# Altium schematic sheet RelayModule_PWR.SchDoc: Релейный модуль
size 594 x 420 mm; ApprovedBy: Иванов; CheckedBy: Вакулин; DrawnBy: Подлесный; DocumentNumber: VSL.23-RELAYMODULE Э3; SheetNumber: 1; SheetTotal: 3; Format: A2; DocumentType: Схема электрическая принципиальная; ImagePath: Введите номер платы
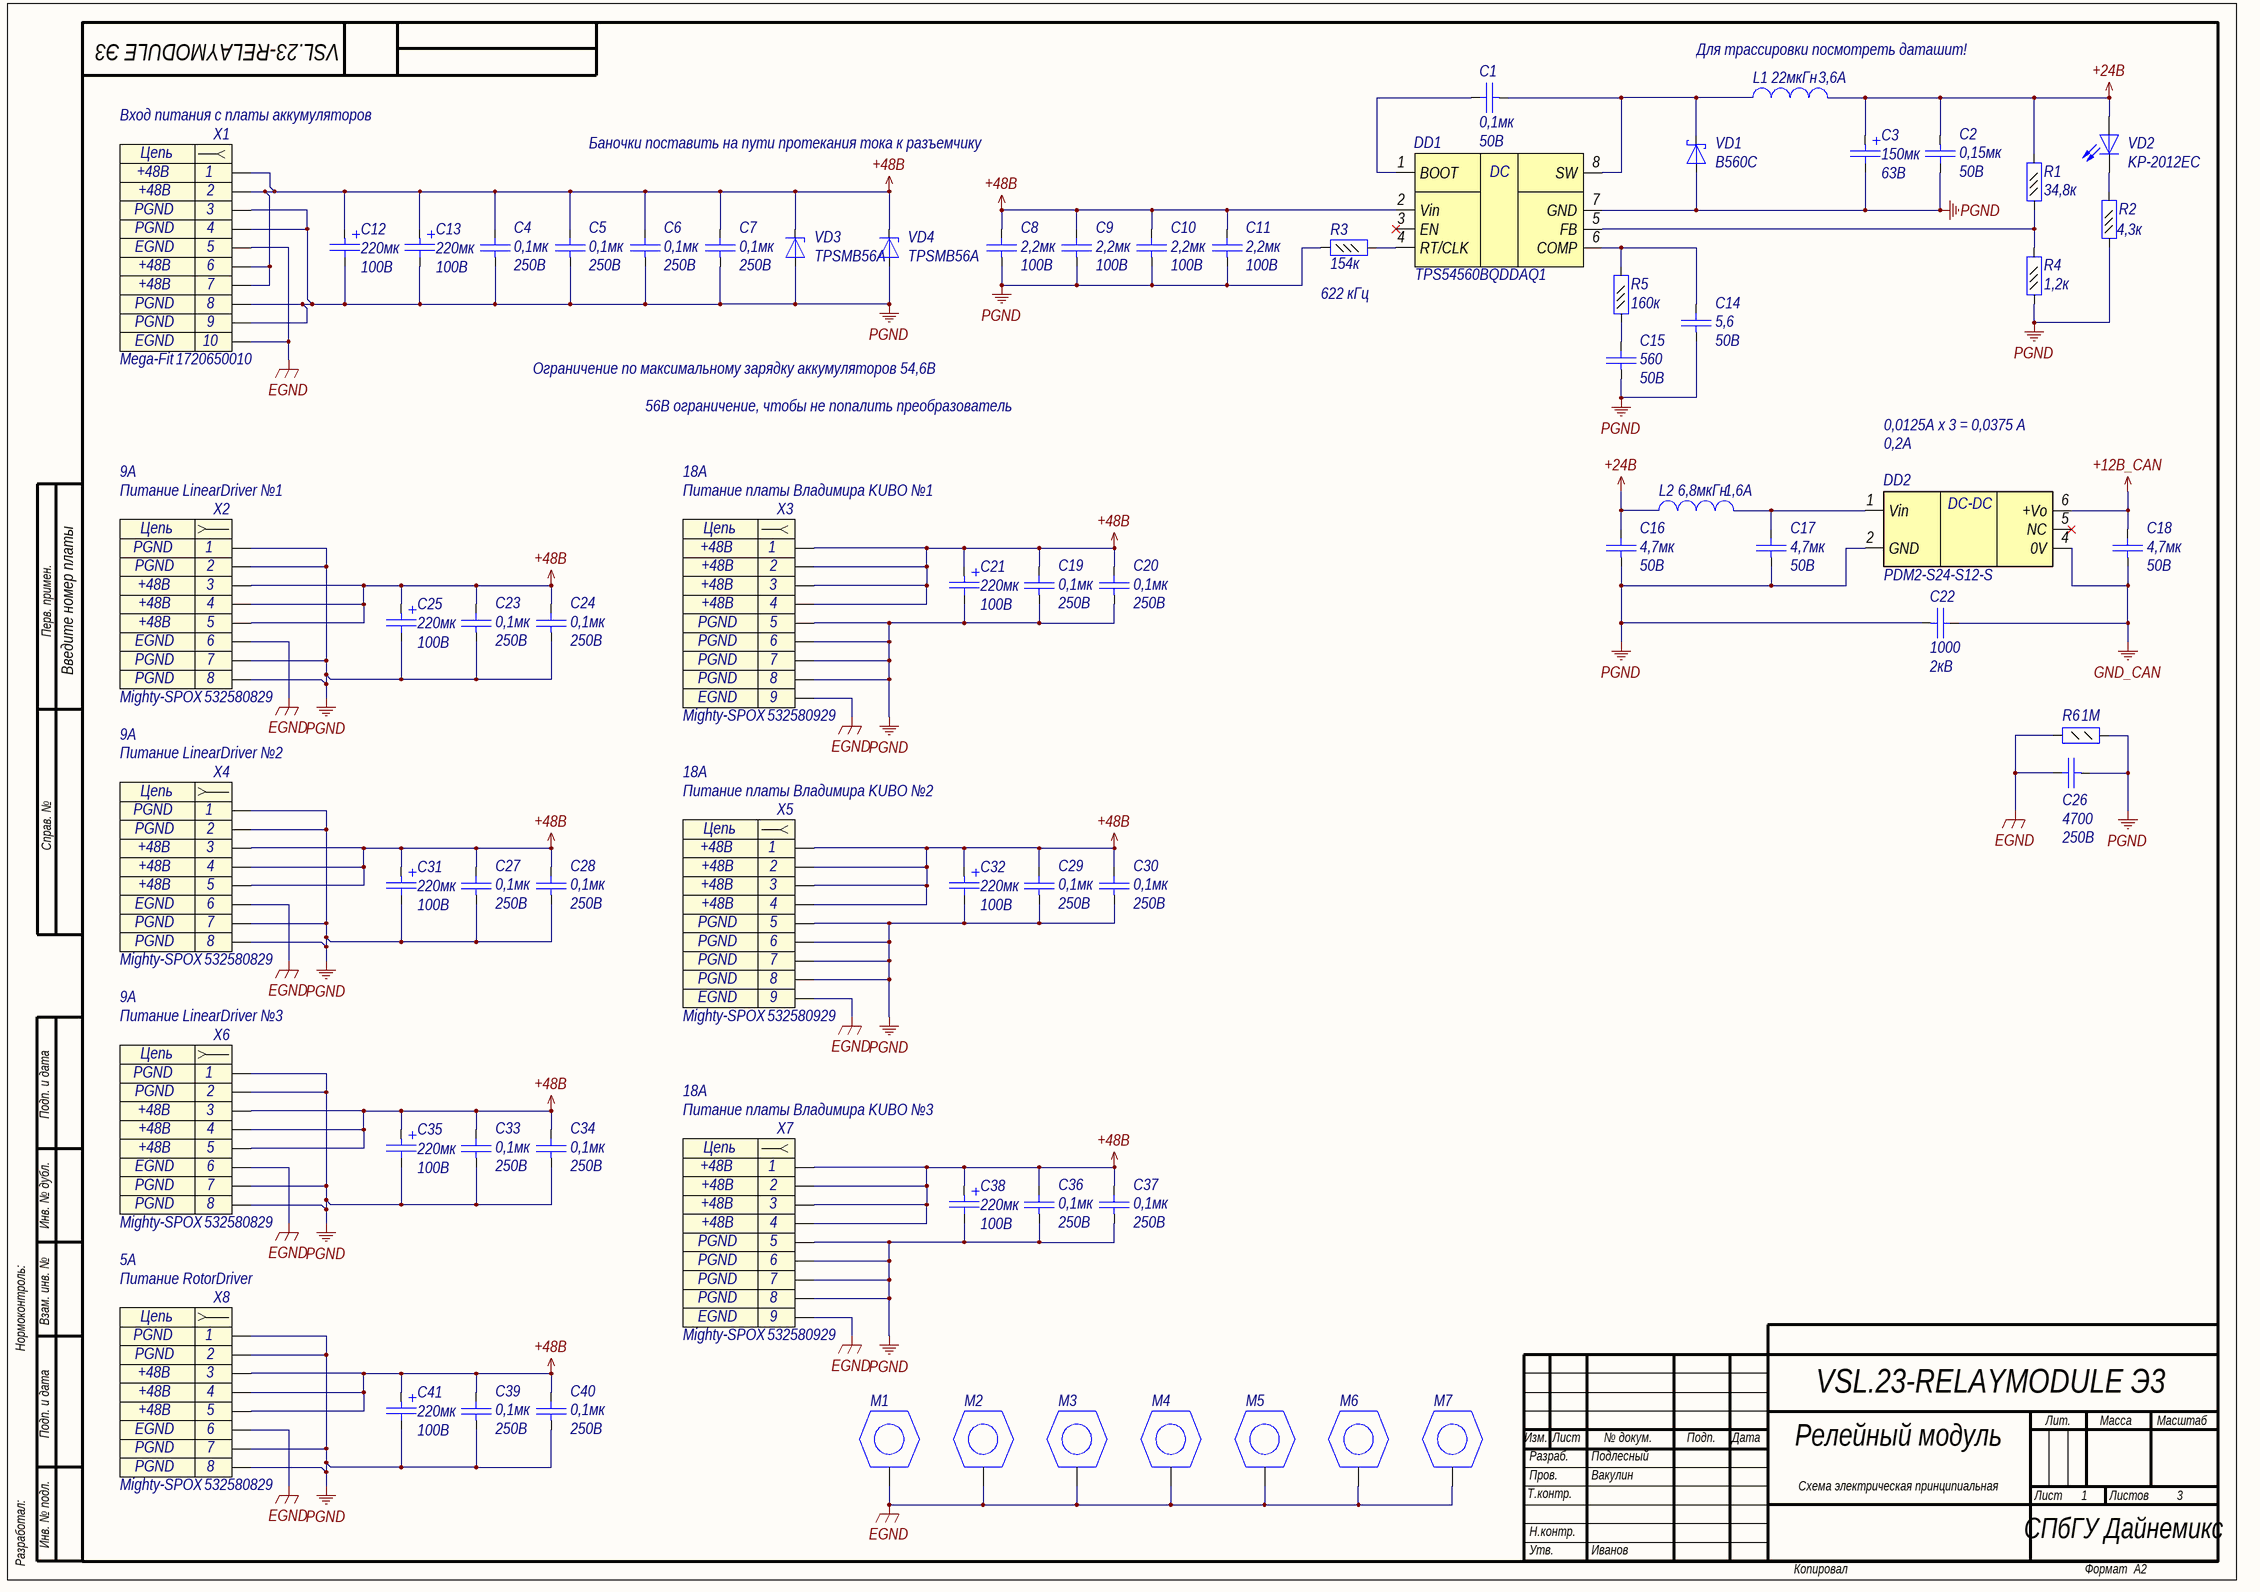
[diagram p0: RelayModule_PWR.SchDoc]

## Parts
C1  Voltage: 50В  [C0402]  (hidden comment: 0,1мк)
C2  Voltage: 50В  [C1812]  (hidden comment: 0,15мк)
C3  value 150мк  Voltage: 63B  [Cap_SMD_radial_polar(10x16.5)]  (hidden comment: Capacitor_pol)
C4  value 0,1мк  Voltage: 250В  [C1206]  (hidden comment: Capacitor)
C5  value 0,1мк  Voltage: 250В  [C1206]  (hidden comment: Capacitor)
C6  value 0,1мк  Voltage: 250В  [C1206]  (hidden comment: Capacitor)
C7  value 0,1мк  Voltage: 250В  [C1206]  (hidden comment: Capacitor)
C8  Voltage: 100В  [C1812]  (hidden comment: 2,2мк)
C9  Voltage: 100В  [C1812]  (hidden comment: 2,2мк)
C10  Voltage: 100В  [C1812]  (hidden comment: 2,2мк)
C11  Voltage: 100В  [C1812]  (hidden comment: 2,2мк)
C12  value 220мк  Voltage: 100B  [K50-35(12.5X25)_V]  (hidden comment: Capacitor_pol)
C13  value 220мк  Voltage: 100B  [K50-35(12.5X25)_V]  (hidden comment: Capacitor_pol)
C14  Voltage: 50B  [C0402]  (hidden comment: 5,6)
C15  Voltage: 50B  [C0402]  (hidden comment: 560)
C16  Voltage: 50В  [C1206]  (hidden comment: 4,7мк)
C17  Voltage: 50В  [C1206]  (hidden comment: 4,7мк)
C18  Voltage: 50В  [C1206]  (hidden comment: 4,7мк)
C19  value 0,1мк  Voltage: 250В  [C1206]  (hidden comment: Capacitor)
C20  value 0,1мк  Voltage: 250В  [C1206]  (hidden comment: Capacitor)
C21  value 220мк  Voltage: 100B  [K50-35(12.5X25)_V]  (hidden comment: Capacitor_pol)
C22  Voltage: 2кB  [C1808]  (hidden comment: 1000)
C23  value 0,1мк  Voltage: 250В  [C1206]  (hidden comment: Capacitor)
C24  value 0,1мк  Voltage: 250В  [C1206]  (hidden comment: Capacitor)
C25  value 220мк  Voltage: 100B  [K50-35(12.5X25)_V]  (hidden comment: Capacitor_pol)
C26  value 4700  Voltage: 250В  [C0805]  (hidden comment: Capacitor)
C27  value 0,1мк  Voltage: 250В  [C1206]  (hidden comment: Capacitor)
C28  value 0,1мк  Voltage: 250В  [C1206]  (hidden comment: Capacitor)
C29  value 0,1мк  Voltage: 250В  [C1206]  (hidden comment: Capacitor)
C30  value 0,1мк  Voltage: 250В  [C1206]  (hidden comment: Capacitor)
C31  value 220мк  Voltage: 100B  [K50-35(12.5X25)_V]  (hidden comment: Capacitor_pol)
C32  value 220мк  Voltage: 100B  [K50-35(12.5X25)_V]  (hidden comment: Capacitor_pol)
C33  value 0,1мк  Voltage: 250В  [C1206]  (hidden comment: Capacitor)
C34  value 0,1мк  Voltage: 250В  [C1206]  (hidden comment: Capacitor)
C35  value 220мк  Voltage: 100B  [K50-35(12.5X25)_V]  (hidden comment: Capacitor_pol)
C36  value 0,1мк  Voltage: 250В  [C1206]  (hidden comment: Capacitor)
C37  value 0,1мк  Voltage: 250В  [C1206]  (hidden comment: Capacitor)
C38  value 220мк  Voltage: 100B  [K50-35(12.5X25)_V]  (hidden comment: Capacitor_pol)
C39  value 0,1мк  Voltage: 250В  [C1206]  (hidden comment: Capacitor)
C40  value 0,1мк  Voltage: 250В  [C1206]  (hidden comment: Capacitor)
C41  value 220мк  Voltage: 100B  [K50-35(12.5X25)_V]  (hidden comment: Capacitor_pol)
DD1  Part Number: TPS54560BQDDAQ1  [SO Powerpad8]  (hidden comment: TPS54560)
DD2  Part Number: PDM2-S24-S12-S  [SIP6]  (hidden comment: PDM2-Sxx-Sxx-S)
L1  value 22мкГн  Rated Current: 3,6A  [IND_12.5x12.5]  (hidden comment: Inductor)
L2  value 6,8мкГн  Rated Current: 1,6A  [SDR0604]  (hidden comment: Inductor)
M1  SCREW  [SCREW3]  (value not drawn)
M2  SCREW  [SCREW3]  (value not drawn)
M3  SCREW  [SCREW3]  (value not drawn)
M4  SCREW  [SCREW3]  (value not drawn)
M5  SCREW  [SCREW3]  (value not drawn)
M6  SCREW  [SCREW3]  (value not drawn)
M7  SCREW  [SCREW3]  (value not drawn)
R1  value 34,8к  [R0402]  (hidden comment: Resistor_0,062Вт)
R2  value 4,3к  [R0402]  (hidden comment: Resistor_0,062Вт)
R3  value 154к  [R0402]  (hidden comment: Resistor_0,062Вт)
R4  value 1,2к  [R0402]  (hidden comment: Resistor_0,062Вт)
R5  value 160к  [R0402]  (hidden comment: Resistor_0,062Вт)
R6  value 1М  [R0805]  (hidden comment: Resistor_0,125Вт)
VD1  Part Number: B560C  [SMC]  (hidden comment: DiodeSchottky)
VD2  Part Number: KP-2012EC  [L_0805]  (hidden comment: LED)
VD3  Part Number: TPSMB56A  [SMB]  (hidden comment: DiodeZener)
VD4  Part Number: TPSMB56A  [SMB]  (hidden comment: DiodeZener)
X1  Вход питания с платы аккумуляторов  Part Name: Mega-Fit  Part Number: 1720650010  [MOLEX_1720650010]
X2  Питание LinearDriver №1  Part Name: Mighty-SPOX  Part Number: 532580829  [MOLEX_532580829]
X3  Питание платы Владимира KUBO №1  Part Name: Mighty-SPOX  Part Number: 532580929  [MOLEX_532580929]
X4  Питание LinearDriver №2  Part Name: Mighty-SPOX  Part Number: 532580829  [MOLEX_532580829]
X5  Питание платы Владимира KUBO №2  Part Name: Mighty-SPOX  Part Number: 532580929  [MOLEX_532580929]
X6  Питание LinearDriver №3  Part Name: Mighty-SPOX  Part Number: 532580829  [MOLEX_532580829]
X7  Питание платы Владимира KUBO №3  Part Name: Mighty-SPOX  Part Number: 532580929  [MOLEX_532580929]
X8  Питание RotorDriver  Part Name: Mighty-SPOX  Part Number: 532580829  [MOLEX_532580829]

## Nets
+12B_CAN: C18.2 DD2.6(+Vo)
+24B: C2.1 C3.1 C16.2 L1.2 L2.1 R1.2 VD2.2(A)
+48B: C4.2 C5.2 C6.2 C7.2 C8.2 C9.2 C10.2 C11.2 C12.1 C13.1 C19.2 C20.2 C21.1 C23.2 C24.2 C25.1 C27.2 C28.2 C29.2 C30.2 C31.1 C32.1 C33.2 C34.2 C35.1 C36.2 C37.2 C38.1 C39.2 C40.2 C41.1 DD1.2(Vin) VD3.1(K) VD4.1(K) X1.1 X1.2 X1.6 X1.7 X2.3 X2.4 X2.5 X3.1 X3.2 X3.3 X3.4 X4.3 X4.4 X4.5 X5.1 X5.2 X5.3 X5.4 X6.3 X6.4 X6.5 X7.1 X7.2 X7.3 X7.4 X8.3 X8.4 X8.5
EGND: C26.2 M1.1 M2.1 M3.1 M4.1 M5.1 M6.1 M7.1 R6.2 X1.5 X1.10 X2.6 X3.9 X4.6 X5.9 X6.6 X7.9 X8.6
GND_CAN: C18.1 C22.2 DD2.4(0V)
PGND: C2.2 C3.2 C4.1 C5.1 C6.1 C7.1 C8.1 C9.1 C10.1 C11.1 C12.2 C13.2 C14.1 C15.1 C16.1 C17.1 C19.1 C20.1 C21.2 C22.1 C23.1 C24.1 C25.2 C26.1 C27.1 C28.1 C29.1 C30.1 C31.2 C32.2 C33.1 C34.1 C35.2 C36.1 C37.1 C38.2 C39.1 C40.1 C41.2 DD1.7(GND) DD2.2(GND) R2.1 R3.1 R4.1 R6.1 VD1.2(A) VD3.2(A) VD4.2(A) X1.3 X1.4 X1.8 X1.9 X2.1 X2.2 X2.7 X2.8 X3.5 X3.6 X3.7 X3.8 X4.1 X4.2 X4.7 X4.8 X5.5 X5.6 X5.7 X5.8 X6.1 X6.2 X6.7 X6.8 X7.5 X7.6 X7.7 X7.8 X8.1 X8.2 X8.7 X8.8
NetC1_1: C1.1 DD1.8(SW) L1.1 VD1.1(K)
NetC1_2: C1.2 DD1.1(BOOT)
NetC14_2: C14.2 DD1.6(COMP) R5.2
NetC15_2: C15.2 R5.1
NetC17_2: C17.2 DD2.1(Vin) L2.2
NetDD1_4: DD1.4(RT/CLK) R3.2
NetDD1_5: DD1.5(FB) R1.1 R4.2
NetR2_2: R2.2 VD2.1(K)

Not connected (* = marked no-connect by the designer): DD1 3(EN)*; DD2 5(NC)*

## Notes on the sheet
- (near L1) Для трассировки посмотреть даташит!
- Баночки поставить на пути протекания тока к разъемчику
- 622 кГц
- Ограничение по максимальному зарядку аккумуляторов 54,6В
- 56В ограничение, чтобы не попалить преобразователь
- 0,0125А х 3 = 0,0375 A
- 0,2A
- 9А
- 18А
- Перв. примен.
- Справ. №
- Подп. и дата
- Инв. № дубл.
- Нормоконтроль:
- Взам. инв. №
- 5А
- Изм.
- Лист
- № докум.
- Подп.
- Дата
- Лит.
- Масса
- Масштаб
- Т.контр.
- Пров.
- Разраб.
- Листов
- Разработал:
- Инв. № подл.
- Н.контр.
- СПбГУ Дайнемикс
- Утв.
- Копировал
- Формат
- (in symbol connect92) Цепь
- (in symbol connect108) Цепь
- (in symbol connect109) Цепь
- (in symbol pwr127) DC
- (in symbol pwr128) DC-DC

## Library data of the parts
C1 = cap277: Конденсатор; Part Name: Ceramic; Manufacture: Murata; Part Number: GRM155R71H104KE14D; id: cap277; TKE: X7R; tga: 0,10%; Value: 0,1мк
C2 = cap285: Конденсатор; Part Name: Ceramic; Manufacture: TDK; Part Number: C4532C0G1H154J250KA; id: cap285; TKE: NP0; Value: 0,15мк
C3 = cap296: Конденсатор полярный; Part Name: Electrolit Polimer; Manufacture: Panasonic; Part Number: EEH-ZS1J151P; id: cap296; tga: 0,20%; ESR: 15мОм; Iac rated: 3,5А
C4-C7 C19 C20 C23 C24 C27-C30 C33 C34 C36 C37 C39 C40 = cap179: Конденсатор; Part Name: Ceramic; Manufacture: Murata; Part Number: GRM31CR72E104K; id: cap179; TKE: X7R
C8-C11 = cap293: Конденсатор; Part Name: MLCC; Manufacture: TDK; Part Number: C4532X7R2A225M; id: cap293; TKE: X7R; tga: 0,10%; Value: 2,2мк
C12 C13 C21 C25 C31 C32 C35 C38 C41 = cap279: Конденсатор полярный; Part Name: Electrolit; Manufacture: Epcos; Part Number: B41851A9227M000; id: cap279; tga: 0,10%; ESR: 75мОм; Iac max: 0,4А; Iac rated: 0,6А
C14 = cap4: Конденсатор; Part Name: Ceramic; Manufacture: Murata; Part Number: GRM1555C1H5R6C; id: cap4; TKE: NP0; Value: 5,6
C15 = cap25: Конденсатор; Part Name: Ceramic; Manufacture: Murata; Part Number: GRM1555C1H561J; id: cap25; TKE: NP0; Value: 560
C16-C18 = cap188: Конденсатор; Part Name: Ceramic; Manufacture: Murata; Part Number: GRM31CR71H475KA12L; id: cap188; TKE: X7R; Value: 4,7мк
C22 = cap266: Конденсатор; Part Name: Ceramic; Manufacture: Murata; Part Number: GR442QR73D102KW01L; id: cap266; TKE: X7R; tga: 0,10%; Value: 1000
C26 = cap211: Конденсатор; Part Name: Ceramic; Manufacture: Murata; Part Number: GRM21AR72E472KW; id: cap211; TKE: X7R
DD1 = pwr127: 5-A, Wide Input Range, Step-Down Converter; Part Name: Step Down DC-DC Converter with Eco-mode; Manufacturer: Texas Instruments; id: pwr127; Input Voltage: 4,5-60В; Output Voltage: 0,8B-58,8B; Current: 5A; Frequency: 100 kHz-25 MHz; Type: Impulse
DD2 = pwr128: DC/DC преобразователь изолированный; Part Name: DC/DC Converter Isolated; Manufacturer: CUI INC; id: pwr128; Input Voltage: 24B; Output Voltage: 12B; Current: 167mA; Power output: 2W; Type: Isolated
L1 = ind79: EMI Suppression Filter; Part Name: SMD Power Inductors; Part Number: B82477G4223M000; Manufacture: Epcos; id: ind79; Saturation Current: 4,25A; Resistance: 0,038Ohm
L2 = ind40: EMI Suppression Filter; Part Name: SMD Power Inductors; Part Number: SDR0604-6R8ML; Manufacture: Bourns; id: ind40; Saturation Current: 2,5A; Resistance: 0,12Ohm
M1-M7 = connect89: Part Name: Винт М3 с заземлением; id: connect89
R1 = res1193: Резистор; Manufacture: Yageo; Part Number: RC0402FR-0734K8L; Accuracy: 0,01; id: res1193; Part Name: Resistor; Power: 0,062Вт
R2 = res285: Резистор; Manufacture: Yageo; Part Number: RC0402FR-074K3; id: res285; Accuracy: 0,01; Part Name: Resistor; Power: 0,062Вт
R3 = res1211: Резистор; Manufacture: Yageo; Part Number: RC0402FR-07154KL; Accuracy: 0,01; id: res1211; Part Name: Resistor; Power: 0,062Вт
R4 = res272: Резистор; Manufacture: Yageo; Part Number: RC0402FR-071K2; id: res272; Accuracy: 0,01; Part Name: Resistor; Power: 0,062Вт
R5 = res323: Резистор; Manufacture: Yageo; Part Number: RC0402FR-07160KL; id: res323; Accuracy: 0,01; Part Name: Resistor; Power: 0,062Вт
R6 = res149: Резистор; Manufacture: Yageo; Part Number: RC0805FR-071ML; id: res149; Accuracy: 0,01; Part Name: Resistor; Power: 0,125Вт
VD1 = diode32: Диод Шоттки; Part Name: SCHOTTKY BARRIER RECTIFIER; Manufacture: Diodes Incorporated; Max Reverse Voltage: 60B; Forward Voltage: 0,7B; Forward Current: 5A; Leakage current: 20mA; Capacitance: 300pF; Number of Channels: 1; id: diode32; Breakdown Voltage: 60B; Temp MAX: +150; Temp MIN: -55
VD2 = diode5: Светодиод; id: diode5; Part Name: LED
VD3 VD4 = TPSMB56A: Cтабилитрон (лавинный выпрямительный диод) односторонний; Part Name: TVS diode Unidirectional; Manufacture: Littelfuse; id: tvs285; Leakage Current: 8uA; Stand-off Voltage: 56B; Breakdown Voltage: 58,8B; Clamping voltage: 77B; Peak Pulse Power: 600W; Number of diodes: 1
X1 = connect109: Разъем - 10 конт. розетка; Manufacture: Molex; Contact_1: +48B; Contact_3: PGND; Contact_5: EGND; Etch: 5.7mm; Contact_2: +48B; Contact_4: PGND; Contact_6: +48B; id: connect109; Contact_7: +48B; Contact_8: PGND; Contact_9: PGND; Contact_10: EGND
X2 X4 X6 X8 = connect108: Разъем - 8 конт. розетка; Manufacture: Molex; Contact_1: PGND; Contact_3: +48B; Contact_6: EGND; Etch: 3.5mm; Contact_2: PGND; Contact_4: +48B; Contact_5: +48B; id: connect108; Contact_7: PGND; Contact_8: PGND
X3 X5 X7 = connect92: Разъем - 9 конт. розетка; Manufacture: Molex; Contact_1: +48B; Contact_5: PGND; Etch: 3.5mm; Contact_9: EGND; Contact_2: +48B; Contact_3: +48B; Contact_4: +48B; Contact_6: PGND; id: connect92; Contact_7: PGND; Contact_8: PGND